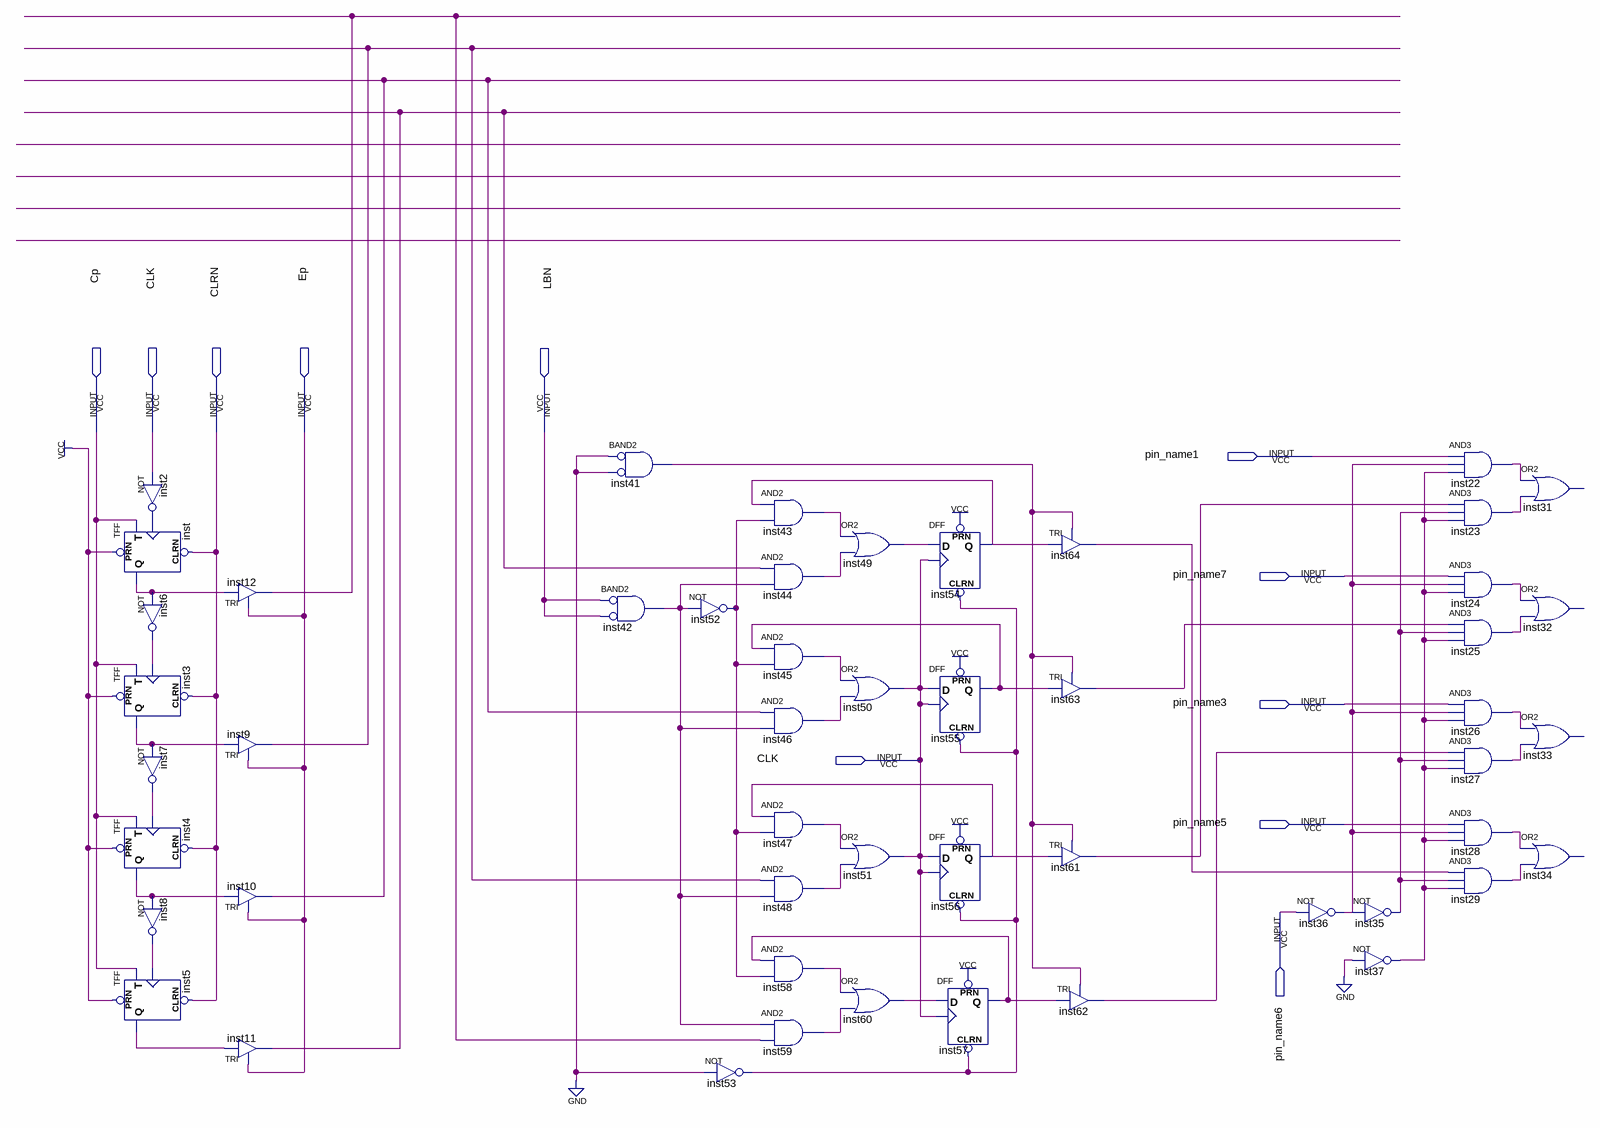
[diagram p0: schematic sheet]
// Quartus schematic Counter_InstructionRegister.bdf as structural Verilog: 51 symbols, 11 pins
module Counter_InstructionRegister (
  input  Cp,
  input  CLK,
  input  CLRN,
  input  Ep,
  input  LBN,
  input  pin_name1,
  input  pin_name7,
  input  pin_name3,
  input  pin_name5,
  input  pin_name6
);

  wire inst2_out, inst3_q, inst4_q, inst5_q, inst6_out, inst7_out, inst8_out, inst9_out, inst10_out,
       inst11_out, inst12_out, inst22_out, inst23_out, inst24_out, inst25_out, inst26_out, inst27_out,
       inst28_out, inst29_out, inst35_out, inst36_out, inst37_out, inst41_out, inst42_out, inst43_out,
       inst44_out, inst45_out, inst46_out, inst47_out, inst48_out, inst49_out, inst52_out, inst53_out,
       inst54_q, inst55_q, inst56_q, inst57_q, inst58_out, inst59_out, inst60_out, inst61_out, inst62_out,
       inst63_out, inst64_out, inst_q;

  not inst2 (inst2_out, CLK);
  TFF inst (.PRN(1'b1), .CLRN(CLRN), .T(Cp), .CLK(inst2_out), .Q(inst_q));
  not inst6 (inst6_out, inst_q);
  TFF inst3 (.PRN(1'b1), .CLRN(CLRN), .T(Cp), .CLK(inst6_out), .Q(inst3_q));
  not inst7 (inst7_out, inst3_q);
  TFF inst4 (.PRN(1'b1), .CLRN(CLRN), .T(Cp), .CLK(inst7_out), .Q(inst4_q));
  not inst8 (inst8_out, inst4_q);
  TFF inst5 (.PRN(1'b1), .CLRN(CLRN), .T(Cp), .CLK(inst8_out), .Q(inst5_q));
  TRI inst12 (.IN(inst_q), .OE(Ep), .OUT(inst12_out));
  TRI inst9 (.IN(inst3_q), .OE(Ep), .OUT(inst9_out));
  TRI inst10 (.IN(inst4_q), .OE(Ep), .OUT(inst10_out));
  TRI inst11 (.IN(inst5_q), .OE(Ep), .OUT(inst11_out));
  and inst42 (inst42_out, ~LBN, ~LBN);  // BAND2
  and inst41 (inst41_out, ~1'b0, ~1'b0);  // BAND2
  not inst52 (inst52_out, inst42_out);
  not inst53 (inst53_out, 1'b0);
  and inst43 (inst43_out, inst54_q, inst52_out);
  and inst44 (inst44_out, inst11_out, inst42_out);
  and inst45 (inst45_out, inst55_q, inst52_out);
  and inst46 (inst46_out, inst10_out, inst42_out);
  and inst47 (inst47_out, inst56_q, inst52_out);
  and inst48 (inst48_out, inst9_out, inst42_out);
  and inst58 (inst58_out, inst57_q, inst52_out);
  and inst59 (inst59_out, inst42_out, inst12_out);
  or inst49 (inst49_out, inst43_out, inst44_out);
  or inst50 (CLK, inst45_out, inst46_out);
  or inst51 (CLK, inst47_out, inst48_out);
  or inst60 (inst60_out, inst58_out, inst59_out);
  DFF inst54 (.CLRN(inst53_out), .CLK(CLK), .D(inst49_out), .PRN(1'b1), .Q(inst54_q));
  DFF inst55 (.CLRN(inst53_out), .CLK(CLK), .D(CLK), .PRN(1'b1), .Q(inst55_q));
  DFF inst56 (.CLRN(inst53_out), .CLK(CLK), .D(CLK), .PRN(1'b1), .Q(inst56_q));
  DFF inst57 (.CLRN(inst53_out), .CLK(CLK), .D(inst60_out), .PRN(1'b1), .Q(inst57_q));
  TRI inst64 (.IN(inst54_q), .OE(inst41_out), .OUT(inst64_out));
  TRI inst63 (.IN(inst55_q), .OE(inst41_out), .OUT(inst63_out));
  TRI inst61 (.IN(inst56_q), .OE(inst41_out), .OUT(inst61_out));
  TRI inst62 (.IN(inst57_q), .OE(inst41_out), .OUT(inst62_out));
  not inst36 (inst36_out, pin_name6);
  not inst35 (inst35_out, inst36_out);
  not inst37 (inst37_out, 1'b0);
  and inst22 (inst22_out, pin_name1, inst36_out, inst37_out);
  and inst23 (inst23_out, inst61_out, inst35_out, inst37_out);
  and inst24 (inst24_out, pin_name7, inst36_out, inst37_out);
  and inst25 (inst25_out, inst63_out, inst35_out, inst37_out);
  and inst26 (inst26_out, pin_name3, inst36_out, inst37_out);
  and inst27 (inst27_out, inst62_out, inst35_out, inst37_out);
  and inst28 (inst28_out, pin_name5, inst36_out, inst37_out);
  and inst29 (inst29_out, inst64_out, inst35_out, inst37_out);
  // OR2 inst31 has open pins: IN1=inst22_out, IN2=inst23_out, OUT=open
  // OR2 inst32 has open pins: IN1=inst24_out, IN2=inst25_out, OUT=open
  // OR2 inst33 has open pins: IN1=inst26_out, IN2=inst27_out, OUT=open
  // OR2 inst34 has open pins: IN1=inst28_out, IN2=inst29_out, OUT=open
endmodule
